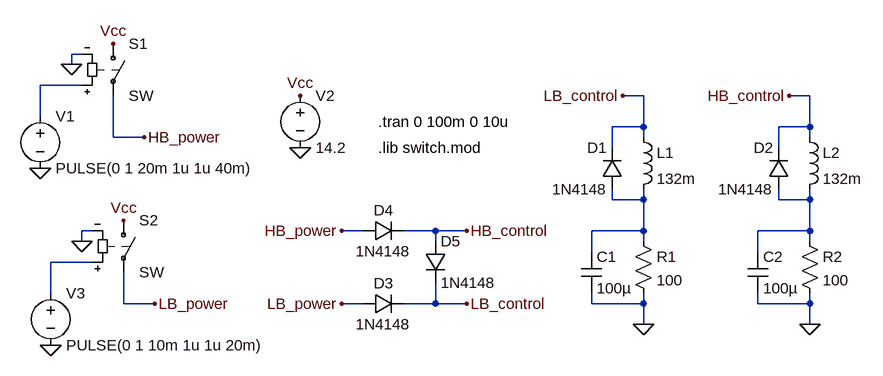
[diagram p0: schematic Draft1.asc]
Draft1.asc, the LTspice schematic file:
Version 4
SHEET 1 880 1324
WIRE -512 784 -528 784
WIRE -528 800 -528 784
WIRE -512 832 -576 832
WIRE 352 848 320 848
WIRE 608 848 576 848
WIRE -576 880 -576 832
WIRE 352 896 352 848
WIRE 352 896 304 896
WIRE 608 896 608 848
WIRE 608 896 560 896
WIRE -464 912 -464 848
WIRE -416 912 -464 912
WIRE 352 912 352 896
WIRE 608 912 608 896
WIRE 304 928 304 896
WIRE 560 928 560 896
WIRE 304 1008 304 992
WIRE 352 1008 352 992
WIRE 352 1008 304 1008
WIRE 560 1008 560 992
WIRE 608 1008 608 992
WIRE 608 1008 560 1008
WIRE -496 1056 -512 1056
WIRE -80 1056 -112 1056
WIRE 32 1056 -16 1056
WIRE 80 1056 32 1056
WIRE 352 1056 352 1008
WIRE 352 1056 272 1056
WIRE 608 1056 608 1008
WIRE 608 1056 528 1056
WIRE -512 1072 -512 1056
WIRE 32 1072 32 1056
WIRE 352 1072 352 1056
WIRE 608 1072 608 1056
WIRE 272 1088 272 1056
WIRE 528 1088 528 1056
WIRE -496 1104 -560 1104
WIRE -560 1152 -560 1104
WIRE -448 1168 -448 1120
WIRE -400 1168 -448 1168
WIRE -80 1168 -112 1168
WIRE 32 1168 32 1136
WIRE 32 1168 -16 1168
WIRE 80 1168 32 1168
WIRE 272 1168 272 1152
WIRE 352 1168 352 1152
WIRE 352 1168 272 1168
WIRE 528 1168 528 1152
WIRE 608 1168 608 1152
WIRE 608 1168 528 1168
WIRE 352 1200 352 1168
WIRE 608 1200 608 1168
FLAG -576 960 0
FLAG -176 848 Vcc
FLAG -464 768 Vcc
FLAG 352 1200 0
FLAG -176 928 0
FLAG -528 800 0
FLAG -448 1040 Vcc
FLAG 608 1200 0
FLAG -512 1072 0
FLAG -560 1232 0
FLAG -400 1168 LB_power
FLAG -416 912 HB_power
FLAG -112 1168 LB_power
FLAG -112 1056 HB_power
FLAG 80 1168 LB_control
FLAG 80 1056 HB_control
FLAG 320 848 LB_control
FLAG 576 848 HB_control
SYMBOL voltage -576 864 R0
WINDOW 123 0 0 Left 2
WINDOW 39 0 0 Left 2
SYMATTR InstName V1
SYMATTR Value PULSE(0 1 20m 1u 1u 40m)
SYMBOL ind 336 896 R0
SYMATTR InstName L1
SYMATTR Value 132m
SYMATTR SpiceLine Rser=90
SYMBOL res 336 1056 R0
SYMATTR InstName R1
SYMATTR Value 100
SYMBOL cap 256 1088 R0
SYMATTR InstName C1
SYMATTR Value 100µ
SYMATTR SpiceLine Rser=100m
SYMBOL sw -464 752 R0
SYMATTR InstName S1
SYMBOL voltage -176 832 R0
WINDOW 123 0 0 Left 2
WINDOW 39 0 0 Left 2
SYMATTR InstName V2
SYMATTR Value 14.2
SYMBOL diode 320 992 R180
WINDOW 0 24 64 Left 2
WINDOW 3 24 0 Left 2
SYMATTR InstName D1
SYMATTR Value 1N4148
SYMBOL ind 592 896 R0
SYMATTR InstName L2
SYMATTR Value 132m
SYMATTR SpiceLine Rser=90
SYMBOL res 592 1056 R0
SYMATTR InstName R2
SYMATTR Value 100
SYMBOL cap 512 1088 R0
SYMATTR InstName C2
SYMATTR Value 100µ
SYMATTR SpiceLine Rser=100m
SYMBOL sw -448 1024 R0
SYMATTR InstName S2
SYMBOL diode 576 992 R180
WINDOW 0 24 64 Left 2
WINDOW 3 24 0 Left 2
SYMATTR InstName D2
SYMATTR Value 1N4148
SYMBOL voltage -560 1136 R0
WINDOW 123 0 0 Left 2
WINDOW 39 0 0 Left 2
SYMATTR InstName V3
SYMATTR Value PULSE(0 1 10m 1u 1u 20m)
SYMBOL diode -80 1184 R270
WINDOW 0 32 32 VTop 2
WINDOW 3 0 32 VBottom 2
SYMATTR InstName D3
SYMATTR Value 1N4148
SYMBOL diode -80 1072 R270
WINDOW 0 32 32 VTop 2
WINDOW 3 0 32 VBottom 2
SYMATTR InstName D4
SYMATTR Value 1N4148
SYMBOL diode 16 1072 R0
SYMATTR InstName D5
SYMATTR Value 1N4148
TEXT -56 888 Left 2 !.tran 0 100m 0 10u
TEXT -56 928 Left 2 !.lib switch.mod

The netlist it stands for:
* Draft1.asc
V1 N001 0 PULSE(0 1 20m 1u 1u 40m)
L1 LB_control N002 132m Rser=90
R1 N002 0 100
C1 N002 0 100µ Rser=100m
S1 Vcc HB_power N001 0 SW
V2 Vcc 0 14.2
D1 N002 LB_control 1N4148
L2 HB_control N003 132m Rser=90
R2 N003 0 100
C2 N003 0 100µ Rser=100m
S2 Vcc LB_power N004 0 SW
D2 N003 HB_control 1N4148
V3 N004 0 PULSE(0 1 10m 1u 1u 20m)
D3 LB_power LB_control 1N4148
D4 HB_power HB_control 1N4148
D5 HB_control LB_control 1N4148
.model D D
.lib standard.dio
.tran 0 100m 0 10u
.lib switch.mod
.backanno
.end